# EAGLE design MT9V024 (EAGLE 9.1.2)
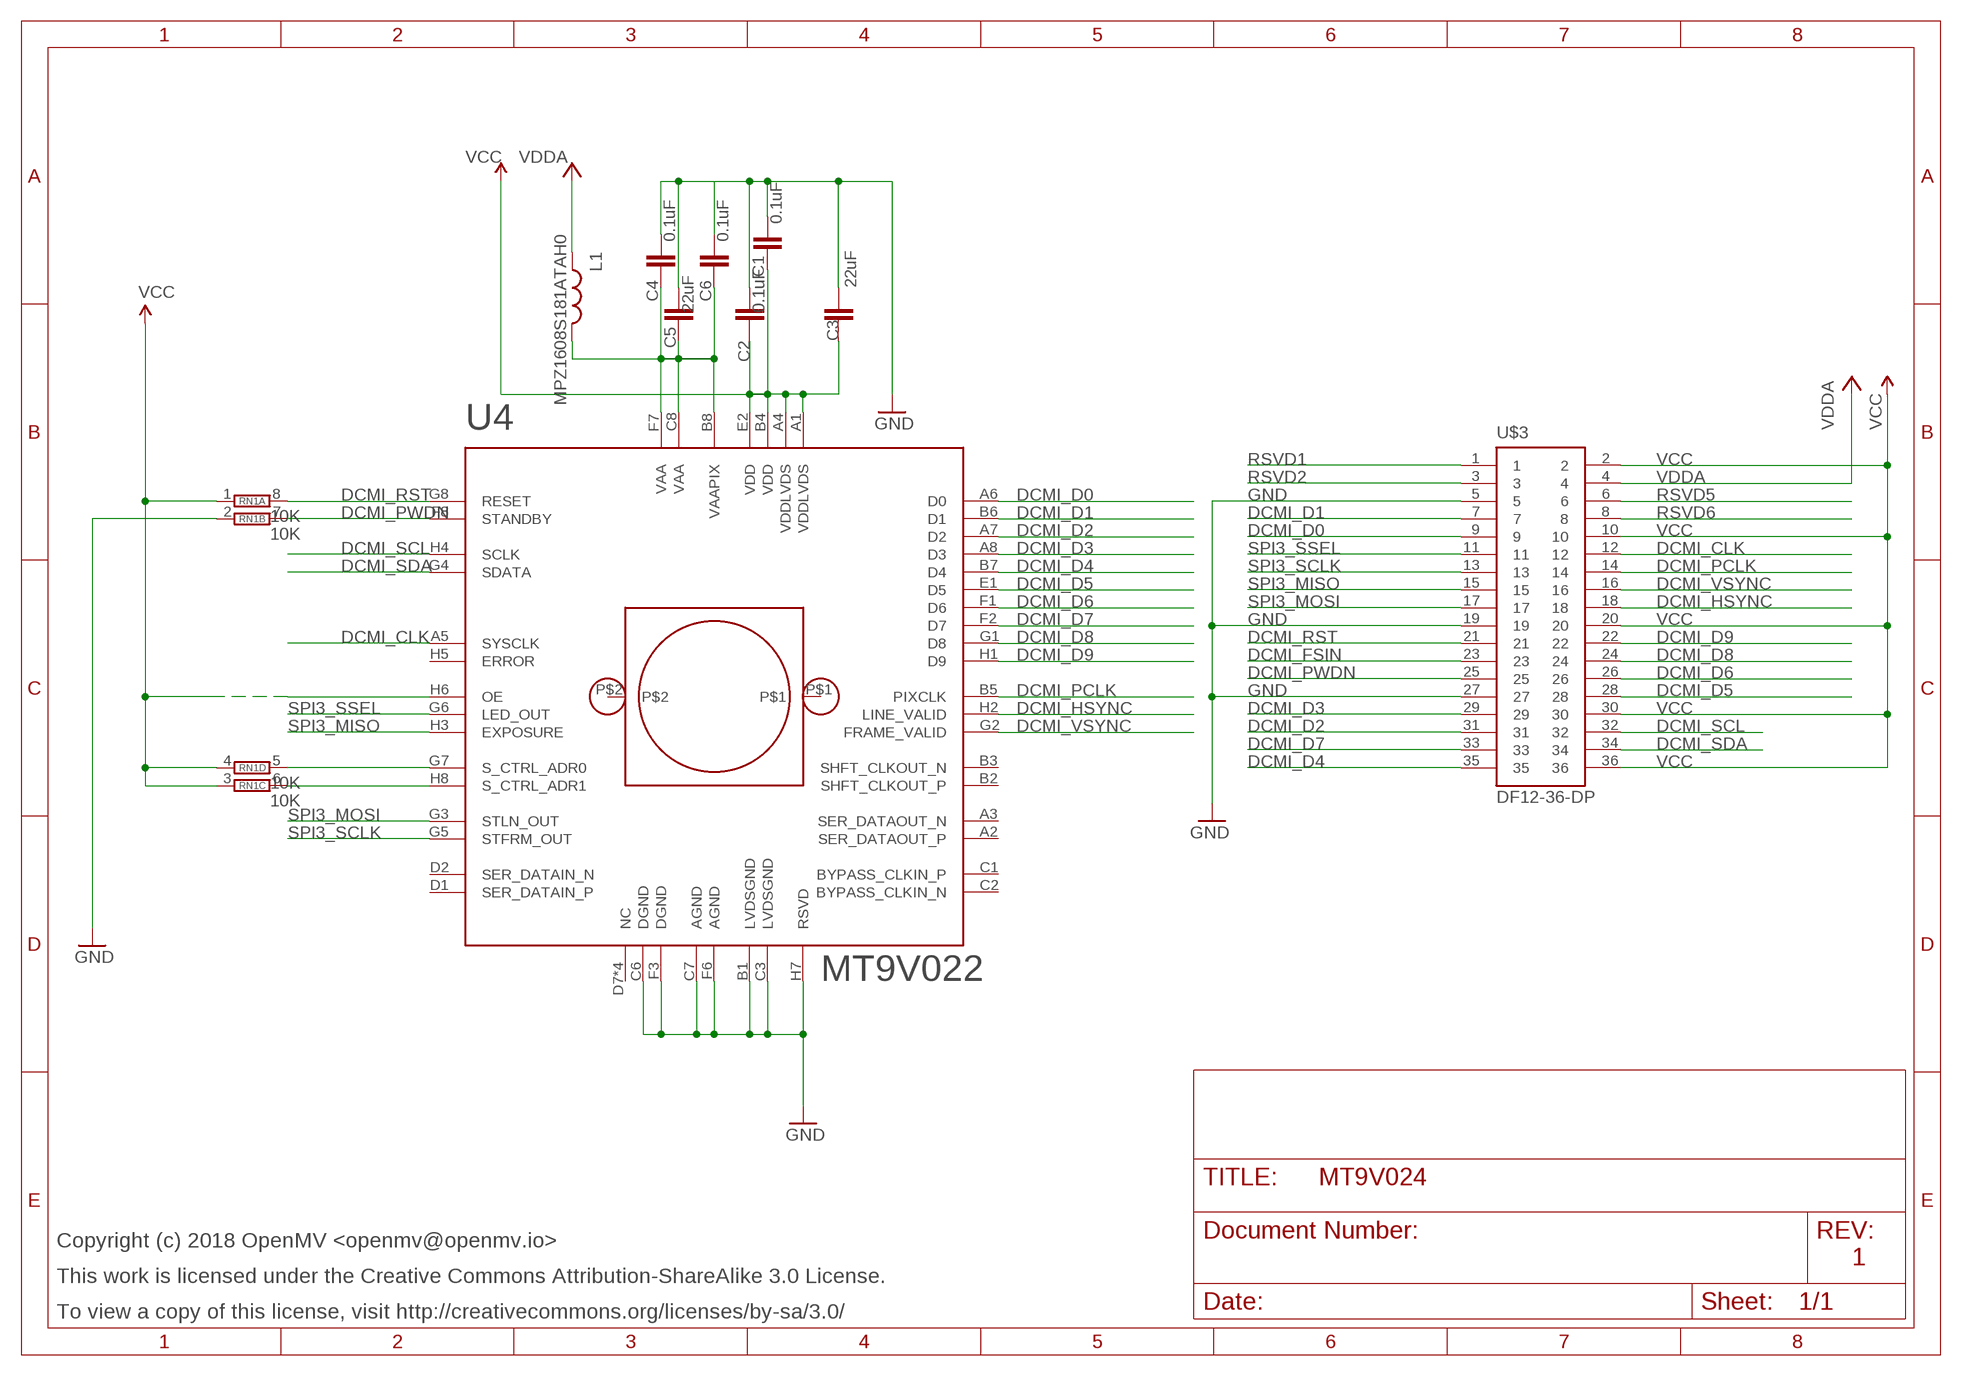
[diagram p0: schematic, sheet 1]

## Parts
C1  0.1uF  CAP0402-CAP  [0402-CAP]
C2  0.1uF  CAP0402-CAP  [0402-CAP]
C3  22uF  CAP0805  [0805]
C4  0.1uF  CAP0402-CAP  [0402-CAP]
C5  22uF  CAP0805  [0805]
C6  0.1uF  CAP0402-CAP  [0402-CAP]
L1  MPZ1608S181ATAH0  INDUCTOR0603  [0603]
LM1  LENSMOUNT20MM  [LENSMOUNT-20MM]
RN1  10K  4R-NEXBV8V  [EXBV8V]
U4  MT9V022  [IBGA52]
U$3  DF12-36-DP  [DF12-36-DP]

## Nets
DCMI_CLK: U4.A5(SYSCLK) U$3.12
DCMI_D0: U4.A6(D0) U$3.9
DCMI_D1: U4.B6(D1) U$3.7
DCMI_D2: U4.A7(D2) U$3.31
DCMI_D3: U4.A8(D3) U$3.29
DCMI_D4: U4.B7(D4) U$3.35
DCMI_D5: U4.E1(D5) U$3.28
DCMI_D6: U4.F1(D6) U$3.26
DCMI_D7: U4.F2(D7) U$3.33
DCMI_D8: U4.G1(D8) U$3.24
DCMI_D9: U4.H1(D9) U$3.22
DCMI_FSIN: U$3.23
DCMI_HSYNC: U4.H2(LINE_VALID) U$3.18
DCMI_PCLK: U4.B5(PIXCLK) U$3.14
DCMI_PWDN: RN1.7 U4.F8(STANDBY) U$3.25
DCMI_RST: RN1.8 U4.G8(RESET) U$3.21
DCMI_SCL: U4.H4(SCLK) U$3.32
DCMI_SDA: U4.G4(SDATA) U$3.34
DCMI_VSYNC: U4.G2(FRAME_VALID) U$3.16
GND: C1.2 C2.2 C3.1 C4.2 C5.1 C6.2 RN1.2 U4.B1(LVDSGND) U4.C3(LVDSGND) U4.C6(DGND) U4.C7(AGND) U4.F3(DGND) U4.F6(AGND) U4.H7(RSVD) U$3.5 U$3.19 U$3.27
N$19: RN1.5 U4.G7(S_CTRL_ADR0)
N$20: RN1.6 U4.H8(S_CTRL_ADR1)
RSVD1: U$3.1
RSVD2: U$3.3
RSVD5: U$3.6
RSVD6: U$3.8
SPI3_MISO: U4.H3(EXPOSURE) U$3.15
SPI3_MOSI: U4.G3(STLN_OUT) U$3.17
SPI3_SCLK: U4.G5(STFRM_OUT) U$3.13
SPI3_SSEL: U4.G6(LED_OUT) U$3.11
VAA: C4.1 C5.2 C6.1 L1.2 U4.B8(VAAPIX) U4.C8(VAA) U4.F7(VAA)
VCC: C1.1 C2.1 C3.2 RN1.1 RN1.3 RN1.4 U4.A1(VDDLVDS) U4.A4(VDDLVDS) U4.B4(VDD) U4.E2(VDD) U4.H6(OE) U$3.2 U$3.10 U$3.20 U$3.30 U$3.36
VDDA: L1.1 U$3.4
Unconnected: LM1.P$1 LM1.P$2 U4.A2(SER_DATAOUT_P) U4.A3(SER_DATAOUT_N) U4.B2(SHFT_CLKOUT_P) U4.B3(SHFT_CLKOUT_N) U4.C1(BYPASS_CLKIN_P) U4.C2(BYPASS_CLKIN_N) U4.D1(SER_DATAIN_P) U4.D2(SER_DATAIN_N) U4.D7(NC) U4.D8(NC) U4.E7(NC) U4.E8(NC) U4.H5(ERROR)

## Notes on the sheet
- Copyright (c) 2018 OpenMV <openmv@openmv.io>
- 1
- This work is licensed under the Creative Commons Attribution-ShareAlike 3.0 License.
- To view a copy of this license, visit http://creativecommons.org/licenses/by-sa/3.0/

## Library data of the parts
C1-C6 = sfe:CAP: Capacitor Standard 0603 ceramic capacitor, and 0.1" leaded capacitor.
L1 = sfe:INDUCTOR: Inductors Basic Inductor/Choke - 0603 and 1206. Footprints are not proven and vary greatly between part numbers.
LM1 = omnivision:LENSMOUNT
RN1 = resistor-dil:4R-N: Array Chip Resistor Source: RS Component / Phycomp; OC_FARNELL: unknown; OC_NEWARK: unknown
U4 = MT9V022:MT9V022
U$3 = DF12:DF12-36-DP

## Board
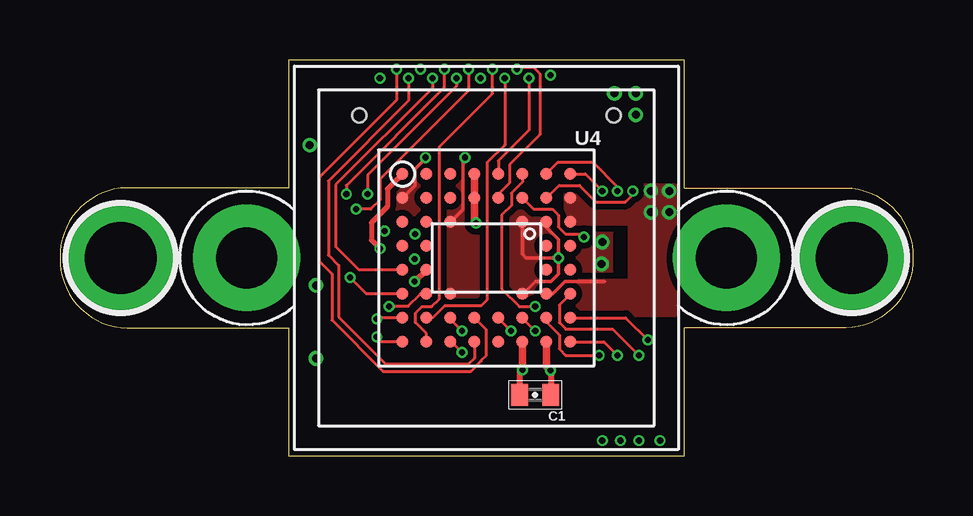
[diagram p1: board, top side]
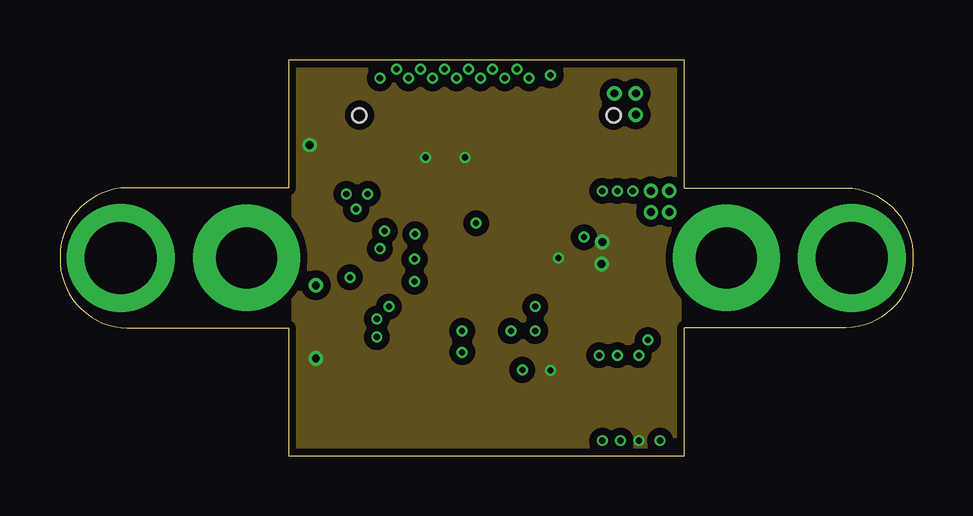
[diagram p2: board, inner layer GND]
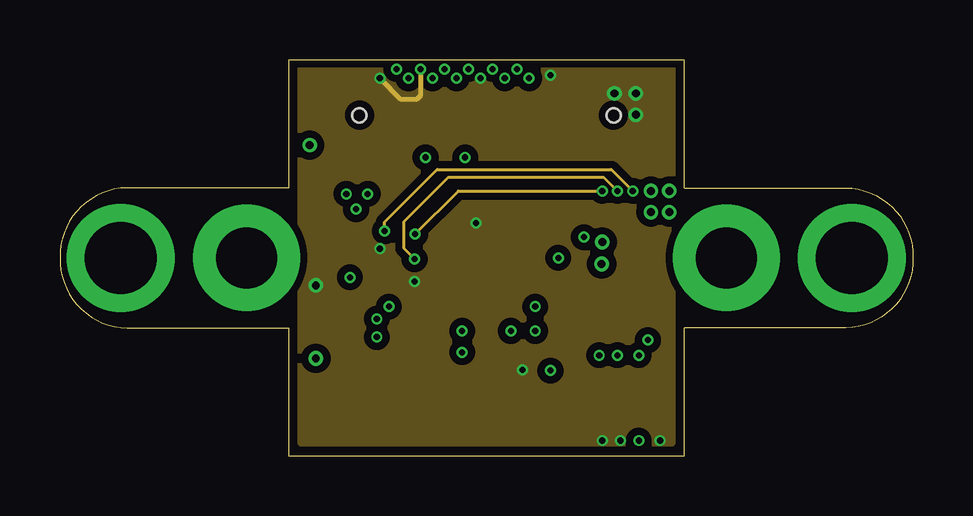
[diagram p3: board, inner layer VCC]
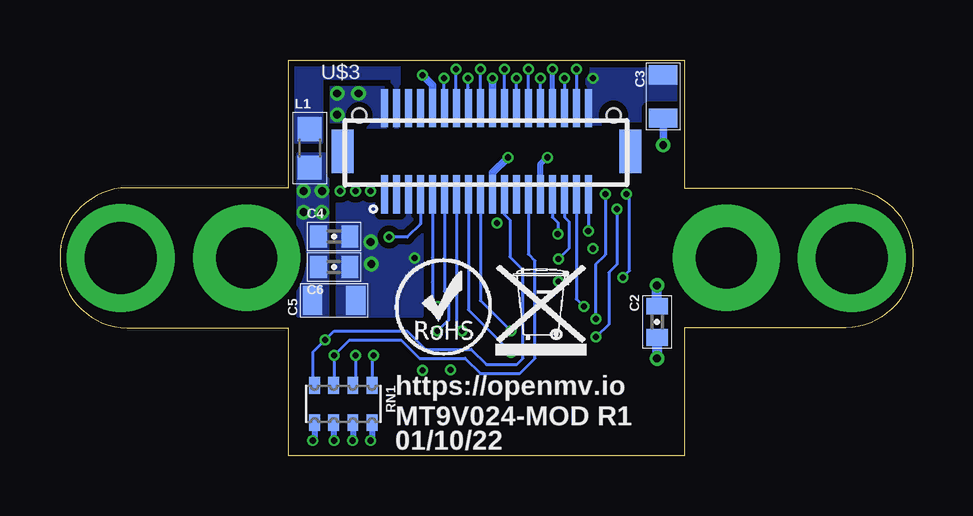
[diagram p4: board, bottom side, seen from below]

Size 35.56 x 16.51 mm. Coordinates in mm from the lower left corner, seen from the top.
Outline: 9.53,16.51 9.53,11.18 2.79,11.18 arc90 0,8.26 arc90 2.79,5.33 9.53,5.33 9.53,0 26.04,0 26.04,5.33 32.77,5.33 arc90 35.56,8.26 arc90 32.77,11.18 26.04,11.18 26.04,16.51 9.53,16.51
Copper layers (1*2+15*16): Top 0.035mm / dielectric 1.5mm / GND 0.035mm / dielectric 0.15mm / VCC 0.035mm / dielectric 0.2mm / Bottom 0.035mm
Design rules "openmv3": minimum track width 5mil, minimum drill 10mil, track to track 6mil, track to pad 6mil, pad to pad 6mil, via to via 6mil, smd to smd 6mil, copper to edge 5mil, drill to drill 10mil, minimum pad ring 10mil, minimum via ring 4mil, stop-mask expansion 2mil, vias tented up to drill 30mil, thermal gap 10mil

### Footprints (pad centres in the part's own frame; a part is rotated, then mirrored left to right if it is on the bottom)
0402-CAP = smd 0.7 x 0.9: 1 -0.65,0; 2 0.65,0
0805 = smd 0.8 x 1.2: 1 -0.9,0; 2 0.9,0
0603 = smd 1 x 1: 1 -0.8,0; 2 0.8,0
LENSMOUNT-20MM = drill 2.54 pad 4.445: P$1 -10,0; P$2 10,0
EXBV8V = smd 0.45 x 0.7: 1 -1.2,-0.775; 2 -0.4,-0.775; 3 0.4,-0.775; 4 1.2,-0.775; 5 1.2,0.775; 6 0.4,0.775; 7 -0.4,0.775; 8 -1.2,0.775
IBGA52 = smd 0.5 x 0.5: A1 -3.5,3.5; A2 -2.5,3.5; A3 -1.5,3.5; A4 -0.5,3.5; A5 0.5,3.5; A6 1.5,3.5; A7 2.5,3.5; A8 3.5,3.5; B1 -3.5,2.5; B2 -2.5,2.5; B3 -1.5,2.5; B4 -0.5,2.5; B5 0.5,2.5; B6 1.5,2.5; B7 2.5,2.5; B8 3.5,2.5; C1 -3.5,1.5; C2 -2.5,1.5; C3 -1.5,1.5; C6 1.5,1.5; C7 2.5,1.5; C8 3.5,1.5; D1 -3.5,0.5; D2 -2.5,0.5; D7 2.5,0.5; D8 3.5,0.5; E1 -3.5,-0.5; E2 -2.5,-0.5; E7 2.5,-0.5; E8 3.5,-0.5; F1 -3.5,-1.5; F2 -2.5,-1.5; F3 -1.5,-1.5; F6 1.5,-1.5; F7 2.5,-1.5; F8 3.5,-1.5; G1 -3.5,-2.5; G2 -2.5,-2.5; G3 -1.5,-2.5; G4 -0.5,-2.5; G5 0.5,-2.5; G6 1.5,-2.5; G7 2.5,-2.5; G8 3.5,-2.5; H1 -3.5,-3.5; H2 -2.5,-3.5; H3 -1.5,-3.5; H4 -0.5,-3.5; H5 0.5,-3.5; H6 1.5,-3.5; H7 2.5,-3.5; H8 3.5,-3.5
DF12-36-DP = smd 0.3 x 1.6: 1 -4.25,-1.8; 2 -4.25,1.8; 3 -3.75,-1.8; 4 -3.75,1.8; 5 -3.25,-1.8; 6 -3.25,1.8; 7 -2.75,-1.8; 8 -2.75,1.8; 9 -2.25,-1.8; 10 -2.25,1.8; 11 -1.75,-1.8; 12 -1.75,1.8; 13 -1.25,-1.8; 14 -1.25,1.8; 15 -0.75,-1.8; 16 -0.75,1.8; 17 -0.25,-1.8; 18 -0.25,1.8; 19 0.25,-1.8; 20 0.25,1.8; 21 0.75,-1.8; 22 0.75,1.8; 23 1.25,-1.8; 24 1.25,1.8; 25 1.75,-1.8; 26 1.75,1.8; 27 2.25,-1.8; 28 2.25,1.8; 29 2.75,-1.8; 30 2.75,1.8; 31 3.25,-1.8; 32 3.25,1.8; 33 3.75,-1.8; 34 3.75,1.8; 35 4.25,-1.8; 36 4.25,1.8 | smd 0.9 x 1.8: F1 -6,0; F2 6,0 | hole 0.6: -5.3,1.5; 5.3,1.5

### Placement (x,y rotation side)
C1  19.81,2.54 0 top
C2  10.67,5.59 270 bottom
C3  10.41,14.99 90 bottom
C4  24.13,9.14 0 bottom
C5  24.13,6.48 180 bottom
C6  24.13,7.87 0 bottom
L1  25.15,12.83 270 bottom
LM1  17.78,8.26 0 top
RN1  23.75,2.16 0 bottom
U4  17.78,8.26 0 top
U$1  [WEEE]  17.4,4.19 0 bottom
U$2  [ROHS]  21.59,4.19 0 bottom
U$3  17.78,12.7 0 bottom

### Tracks (layer width: path | path; a pad name or v marks a point on that pad's centre or on a via)
DCMI_CLK  (via drill 0.25)
  Top 0.127: v19.56,15.75 19.56,13.59 18.28,12.31 U4.A5
  Bottom 0.127: v19.56,15.75 19.56,14.53 U$3.12
DCMI_D0  (via drill 0.25)
  Top 0.127: U4.A6 19.28,11.41 18.81,10.95 18.81,10.43 18.41,10.03 18.41,6.96 19.15,6.22 19.56,6.22 v19.81,6.22
  Bottom 0.127: U$3.9 20.03,8.26 20.03,7.24 20.03,6.44 v19.81,6.22
DCMI_D1  (via drill 0.25)
  Top 0.127: v21.84,9.12 21.72,9.25 21.08,9.25 20.78,9.55 20.78,10.03 20.52,10.29 19.89,10.29 19.75,10.29 U4.B6
  Bottom 0.127: U$3.7 20.53,9.67 21.08,9.12 v21.84,9.12
DCMI_D2  (via drill 0.25)
  Top 0.127: U4.A7 20.28,11.77 20.73,12.22 22.23,12.22 23.24,11.21 v23.24,11.05
  VCC 0.127: v23.24,11.05 v23.23,11.05 22.66,11.62 16.19,11.62 14.35,9.78 14.35,8.64 v14.78,8.2
  Bottom 0.127: U$3.31 14.52,10.89 14.52,9.95 14.35,9.78 14.35,8.64 v14.78,8.2
DCMI_D3  (via drill 0.25)
  Top 0.127: v22.61,11.05 22.35,11.3 21.9,11.76 U4.A8
  VCC 0.127: v14.81,9.25 16.61,11.05 v22.61,11.05
  Bottom 0.127: U$3.29 15.03,9.95 14.81,9.73 v14.81,9.25
DCMI_D4  (via drill 0.25)
  Top 0.127: U4.B7 20.8,11.28 21.67,11.28 22.35,10.59 23.57,10.59 23.88,10.9 v23.88,11.05
  VCC 0.127: v23.88,11.05 22.99,11.94 15.72,11.94 13.54,9.75 v13.54,9.37
  Bottom 0.127: v13.54,9.37 U$3.35
DCMI_D5  (via drill 0.25)
  Top 0.127: U4.E1 12.46,7.75 11.49,8.72 11.49,11.3 15.53,15.34 v15.53,15.75
  Bottom 0.127: U$3.28 15.53,14.73 v15.53,15.75
DCMI_D6  (via drill 0.25)
  Top 0.127: v16.03,16.13 16.03,15.37 11.94,11.28 v11.94,10.92 | U4.F1 12.78,6.75 v12.09,7.44
  Bottom 0.127: U$3.26 v16.03,16.13 | v12.09,7.44 11.81,7.72 11.81,10.79 v11.94,10.92
DCMI_D7  (via drill 0.25)
  Top 0.127: v13.72,6.22 13.74,6.25 14.52,6.25 15.03,6.75 U4.F2
  Bottom 0.127: v13.72,6.22 14.03,6.54 U$3.33
DCMI_D8  (via drill 0.25)
  Top 0.127: v16.53,15.75 16.53,15.41 12.83,11.71 v12.83,10.92 | v13.21,5.71 13.23,5.74 14.27,5.74 U4.G1
  Bottom 0.127: U$3.24 v16.53,15.75 | v13.21,5.71 13.21,8 12.83,8.38 v12.83,10.92
DCMI_D9  (via drill 0.25)
  Top 0.127: v17.03,16.13 17.03,15.23 13.98,12.18 13.34,11.53 13.34,10.67 12.95,10.29 v12.34,10.29 | U4.H1 13.41,4.75 v13.21,4.95
  Bottom 0.127: U$3.22 v17.03,16.13 | v12.34,10.29 12.34,7.98 12.68,7.64 12.68,5.49 v13.21,4.95
DCMI_HSYNC  (via drill 0.25)
  Top 0.127: v18.03,16.13 18.03,15.37 18.03,15.11 15.81,12.89 15.81,6.54 15.49,6.22 15.09,6.22 14.81,5.95 14.81,5.56 15.28,5.1 U4.H2
  Bottom 0.127: U$3.18 v18.03,16.12 v18.03,16.13
DCMI_PCLK  (via drill 0.25)
  Top 0.127: v19.05,16.13 19.13,16.2 19.73,16.2 20,15.93 20,13.4 18.75,12.14 18.75,11.38 18.28,10.91 U4.B5
  Bottom 0.127: v19.05,16.13 19.05,14.52 U$3.14
DCMI_PWDN  (via drill 0.25)
  Top 0.127: v24.13,4.19 23.03,5.29 21.09,5.29 20.81,5.56 20.81,6.29 U4.F8
  Bottom 0.127: U$3.25 16.03,8.41 15.75,8.13 15.75,4.06 16.38,3.43 18.03,3.43 18.67,4.06 20.57,4.06 21.34,4.83 23.5,4.83 v24.13,4.19 24.13,2.95 RN1.7
DCMI_RST  (via drill 0.25)
  Top 0.127: v24.51,4.83 23.58,5.75 U4.G8
  Bottom 0.127: RN1.8 25.02,3 25.02,4.32 v24.51,4.83 24.13,5.21 21.08,5.21 20.32,4.45 18.41,4.45 17.78,3.81 16.51,3.81 16.26,4.06 16.26,7.75 16.8,8.29 16.8,9.84 17.03,10.07 U$3.21
DCMI_SCL  (via drill 0.25)
  Top 0.127: v14.53,15.75 14.53,14.81 11.19,11.47 11.19,8.37 11.62,7.94 11.62,5.79 13.34,4.07 13.34,4.06 13.59,3.81 17.02,3.81 17.28,4.07 U4.H4
  Bottom 0.127: v14.53,15.75 U$3.32
DCMI_SDA  (via drill 0.25)
  Top 0.127: v14.03,16.13 14.03,14.83 10.79,11.6 10.79,8.13 11.34,7.58 11.34,5.66 13.47,3.53 17.13,3.53 17.56,3.96 17.56,3.97 17.78,4.19 17.78,5.25 U4.G4
  Bottom 0.127: v14.03,16.13 U$3.34
DCMI_VSYNC  (via drill 0.25)
  Top 0.127: U4.G2 15.53,5.75 16.04,6.26 17.57,6.26 17.81,6.51 17.81,12.24 18.54,12.97 v18.54,15.75
  Bottom 0.127: v18.54,15.75 18.54,15.37 18.54,14.51 U$3.16
GND  (via drill 0.25, 0.33, 0.33 pad 0.61)
  Top 0.127: U4.F6 19.3,6.75 19.82,7.28
  Top 0.152: v20.78,8.26 20.78,9.02 20.28,9.51 U4.C7 | 19.82,7.28 20.48,7.28 20.78,7.58 v20.78,8.26 | U4.C6 19.28,8.41 19.43,8.26 v20.78,8.26 | U4.B1 14.8,11.28 14.8,11.95 15.24,12.39 v15.24,12.45 | U4.C3 16.8,10.28 16.8,12.45 v16.89,12.45
  Top 0.254: v20.45,3.56 20.46,3.54 C1.2
  Top 0.305: U4.H7 20.28,3.72 v20.45,3.56
  Bottom 0.254: RN1.2 24.15,0.65 v24.13,0.64 | U$3.27 15.53,12.16 v15.24,12.45
  Bottom 0.305: v16.89,12.45 17.53,11.81 U$3.19 | C3.1 v10.41,12.95
  Bottom 0.406: C2.2 v10.67,4.06
  other vias: 22.61,8.92 22.58,8
  pour GND (isolate 0.305): 9.78,0.25 9.78,16.26 25.78,16.26 25.78,0.25
  pour Bottom (isolate 0.254, rank 5, no thermals): 20.45,11.58 24,11.58 24,5.84 20.45,5.84
  pour Top (isolate 0.254, rank 5, no thermals): 13.74,12.01 22.99,12.01 22.99,6.48 13.74,6.48
N$3  (via drill 3 pad 4.5)
  other vias: 2.54,8.26
N$4  (via drill 3 pad 4.5)
  other vias: 33.02,8.26
N$19  (via drill 0.25)
  Top 0.127: v22.48,4.19 21.08,4.19 20.81,4.46 20.81,5.04 20.28,5.57 U4.G7
  Bottom 0.127: v22.48,4.19 22.55,4.12 RN1.5
N$20  (via drill 0.25)
  Top 0.127: U4.H8 22.68,4.75 v23.24,4.19
  Bottom 0.127: v23.24,4.19 23.24,3.04 RN1.6
SPI3_MISO  (via drill 0.25)
  Top 0.127: v16.76,4.32 16.33,4.75 U4.H3
  Bottom 0.127: U$3.15 18.53,6.08 v16.76,4.32
SPI3_MOSI  (via drill 0.25)
  Top 0.127: U4.G3 16.25,5.72 v16.76,5.21
  Bottom 0.127: U$3.17 18.03,6.47 v16.76,5.21
SPI3_SCLK  (via drill 0.25)
  Top 0.127: v18.8,5.21 18.28,5.72 U4.G5
  Bottom 0.127: U$3.13 19.03,5.44 v18.8,5.21
SPI3_SSEL  (via drill 0.25)
  Top 0.127: v19.81,5.21 19.79,5.23 19.28,5.74 U4.G6
  Bottom 0.127: v19.81,5.21 19.36,5.66 19.36,6.69 19.53,6.86 U$3.11
VAA  (via drill 0.33)
  Top 0.152: U4.F7 20.53,6.75 21.04,7.26 22.71,7.26
  other vias: 24.64,11.05 25.4,11.05 24.64,10.16 25.4,10.16
  pour Bottom (isolate 0.254, no thermals): 24.38,5.84 24.38,12.57 25.65,12.57 25.65,9.65 25.65,5.84
  pour Top (isolate 0.254, rank 3, no thermals): 20.95,5.84 20.95,7.34 23.75,7.34 23.75,9.65 21.08,9.65 21.08,11.3 25.65,11.3 25.65,5.84
VCC  (via drill 0.25, 0.33 pad 0.61)
  Top 0.203: U4.A1 13.65,11.13 13.65,10.4 12.98,9.72 12.98,8.99 v13.34,8.64
  Top 0.254: v14.78,7.26 v14.79,7.26 U4.E2 | v19.28,3.58 19.16,3.46 C1.1
  Top 0.305: U4.H6 19.28,4.41 v19.28,3.58 | U4.A4 17.28,11.3 U4.B4 17.27,10.75 17.27,9.78 v17.35,9.7
  VCC 0.203: v15.03,16.13 15.03,15.03 14.86,14.86 14.22,14.86 v13.34,15.75
  Bottom 0.203: U$3.30 v15.03,16.13
  Bottom 0.254: RN1.1 24.95,0.7 v25.02,0.64 | RN1.3 23.35,0.65 v23.37,0.64 | RN1.4 22.55,0.69 v22.61,0.64
  Bottom 0.305: U$3.20 v17.53,15.74 v17.53,15.75 | U$3.10 20.03,15.46 v20.45,15.88
  Bottom 0.406: C2.1 v10.67,7.11
  other vias: 24,15.11 24,14.22 23.11,15.11
  pour Bottom (isolate 0.254, rank 6, no thermals): 21.84,13.72 21.84,15.49 24.26,15.49 24.26,13.72
  pour Bottom (isolate 0.305, rank 2, no thermals): 9.65,16.26 13.72,16.26 13.72,13.84 11.05,13.84 9.65,13.84
  pour VCC (isolate 0.305): 10.03,0.51 10.03,16.38 25.53,16.38 25.53,0.51
VDDA
  pour Bottom (isolate 0.254, rank 3, no thermals): 21.4,13.72 21.4,16.51 25.78,16.51 25.78,13.08 24.64,13.08 24.64,15.75 21.72,15.75 21.72,13.72

### Text on the board
bPlace: https://openmv.io | MT9V024-MOD R1 | 01/10/22